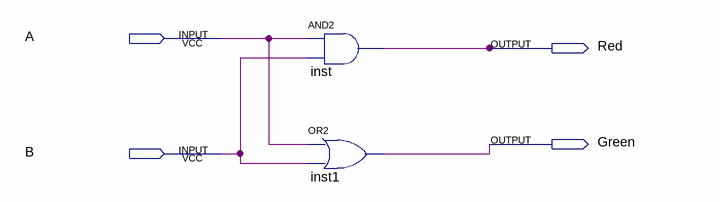
[diagram p0: schematic sheet]
// Quartus schematic comb_ckt.bdf as structural Verilog: 2 symbols, 4 pins
module comb_ckt (
  input  A,
  input  B,
  output Red,
  output Green
);

  and inst (Red, A, B);
  or inst1 (Green, A, B);
endmodule
